# EAGLE design schemat (EAGLE 8.2.2)
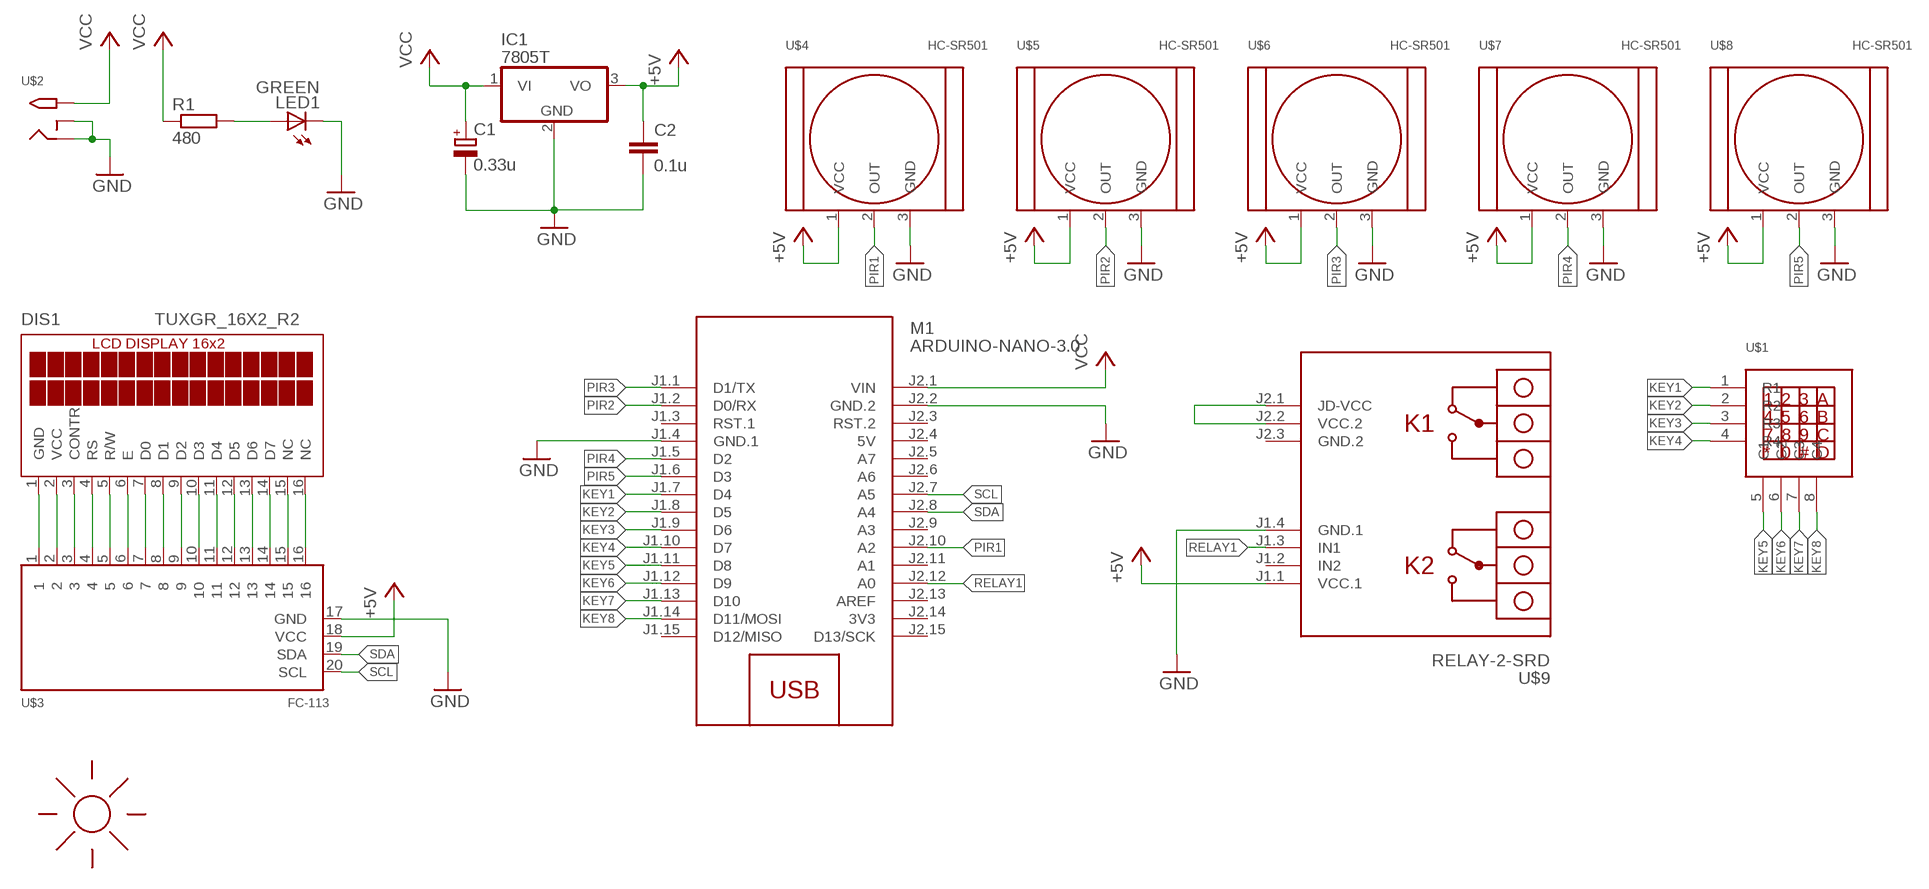
[diagram p0: schematic, sheet 1]

## Parts
C1  0.33u  CPOL-EUE5-4  [E5-4]
C2  0.1u  C-EU050-025X075  [C050-025X075]
DIS1  TUXGR_16X2_R2  [TUXGR_16X2_R2]
IC1  7805T  [TO220H]
LED1  GREEN  LED5MM  [LED5MM]
M1  ARDUINO-NANO-3.0  [ARDUINO-NANO-3.0]
R1  480  R-EU_0204/7  [0204/7]
U$1  KEYPAD4X4  [KEYPAD4X4]
U$2  2.1MMJACKTHM  [PJ-102A]
U$3  FC-113  [FC-113]
U$4  HC-SR501  [HC-SR501]
U$5  HC-SR501  [HC-SR501]
U$6  HC-SR501  [HC-SR501]
U$7  HC-SR501  [HC-SR501]
U$8  HC-SR501  [HC-SR501]
U$9  RELAY-2-SRD  [RELAY-2-SRD]
U$10  SUNLOGO  [SUN]

## Nets
+5V: C2.1 IC1.3(VO) U$3.18(VCC) U$4.1(VCC) U$5.1(VCC) U$6.1(VCC) U$7.1(VCC) U$8.1(VCC) U$9.J1.1(VCC.1)
GND: C1.- C2.2 IC1.2(GND) LED1.K(C) M1.J1.4(GND.1) M1.J2.2(GND.2) U$2.RING U$2.RING_SW U$3.17(GND) U$4.3(GND) U$5.3(GND) U$6.3(GND) U$7.3(GND) U$8.3(GND) U$9.J1.4(GND.1)
KEY1: M1.J1.7(D4) U$1.1(R1)
KEY2: M1.J1.8(D5) U$1.2(R2)
KEY3: M1.J1.9(D6) U$1.3(R3)
KEY4: M1.J1.10(D7) U$1.4(R4)
KEY5: M1.J1.11(D8) U$1.5(C1)
KEY6: M1.J1.12(D9) U$1.6(C2)
KEY7: M1.J1.13(D10) U$1.7(C3)
KEY8: M1.J1.14(D11/MOSI) U$1.8(C4)
N$1: DIS1.15(NC) U$3.15
N$2: LED1.A R1.2
N$5: DIS1.1(GND) U$3.1
N$6: DIS1.2(VCC) U$3.2
N$7: DIS1.3(CONTR) U$3.3
N$8: DIS1.4(RS) U$3.4
N$9: DIS1.5(R/W) U$3.5
N$10: DIS1.6(E) U$3.6
N$11: DIS1.7(D0) U$3.7
N$12: DIS1.8(D1) U$3.8
N$13: DIS1.9(D2) U$3.9
N$14: DIS1.10(D3) U$3.10
N$15: DIS1.11(D4) U$3.11
N$16: DIS1.12(D5) U$3.12
N$17: DIS1.13(D6) U$3.13
N$18: DIS1.14(D7) U$3.14
N$20: DIS1.16(NC) U$3.16
N$30: U$9.J2.1(JD-VCC) U$9.J2.2(VCC.2)
PIR1: M1.J2.10(A2) U$4.2(OUT)
PIR2: M1.J1.2(D0/RX) U$5.2(OUT)
PIR3: M1.J1.1(D1/TX) U$6.2(OUT)
PIR4: M1.J1.5(D2) U$7.2(OUT)
PIR5: M1.J1.6(D3) U$8.2(OUT)
RELAY1: M1.J2.12(A0) U$9.J1.3(IN1)
SCL: M1.J2.7(A5) U$3.20(SCL)
SDA: M1.J2.8(A4) U$3.19(SDA)
VCC: C1.+ IC1.1(VI) M1.J2.1(VIN) R1.1 U$2.TIP
Unconnected: M1.J1.3(RST.1) M1.J1.15(D12/MISO) M1.J2.3(RST.2) M1.J2.5(A7) M1.J2.6(A6) M1.J2.9(A3) M1.J2.11(A1) M1.J2.13(AREF) M1.J2.15(D13/SCK) U$9.J1.2(IN2) U$9.J2.3(GND.2)

## Power pins joined to a net without a drawn wire
3V3: M1.J2.14(3V3)
5V: M1.J2.4(5V)

## Library data of the parts
C1 = resistor:CPOL-EU: POLARIZED CAPACITOR, European symbol
C2 = resistor:C-EU: CAPACITOR, European symbol
DIS1 = display-lcd:TUXGR_16X2_R2: Tuxgraphics LCD display 16x2 characters reflective, without background light Source: tuxgr_12x2_r2.pdf; OC_FARNELL: unknown; OC_NEWARK: unknown
IC1 = adafruit:78*: Positive VOLTAGE REGULATOR Added bigger pads to the TO-92 package
LED1 = adafruit:LED: LED OSRAM: - CHIPLED LG R971, LG N971, LY N971, LG Q971, LY Q971, LO R971, LY R971 LH N974, LH R974 LS Q976, LO Q976, LY Q976 LO Q996 - Hyper CHIPLED LW Q18S LB Q993, LB Q99A, LB R99A - SideLED LS A670, LO A670, LY A670, LG A670, LP A670 LB A673, LV A673, LT A673, LW A673 LH A674 LY A675 LS A676, LA A676, LO A676, LY A676, LW A676 LS A679, LY A679, LG A679 - Hyper Micro SIDELED® LS Y876, LA Y876, LO Y876, LY Y876 LT Y87S - SmartLED LW L88C, LW L88S LB L89C, LB L89S, LG L890 LS L89K, LO L89K, LY L89K LS L896, LA L896, LO L896, LY L896 - TOPLED LS T670, LO T670, LY T670, LG T670, LP T670 LSG T670, LSP T670, LSY T670, LOP T670, LYG T670 LG T671, LOG T671, LSG T671 LB T673, LV T673, LT T673, LW T673 LH T674 LS T676, LA T676, LO T676, LY T676, LB T676, LH T676, LSB T676, LW T676 LB T67C, LV T67C, LT T67C, LS T67K, LO T67K, LY T67K, LW E67C LS E67B, LA E67B, LO E67B, LY E67B, LB E67C, LV E67C, LT E67C LW T67C LS T679, LY T679, LG T679 LS T770, LO T770, LY T770, LG T770, LP T770 LB T773, LV T773, LT T773, LW T773 LH T774 LS E675, LA E675, LY E675, LS T675 LS T776, LA T776, LO T776, LY T776, LB T776 LHGB T686 LT T68C, LB T68C - Hyper Mini TOPLED® LB M676 - Mini TOPLED Santana® LG M470 LS M47K, LO M47K, LY M47K Source: http://www.osram.convergy.de/
M1 = diy-modules:ARDUINO-NANO-3.0: Arduino Nano 3.0 and compatible devices More details available here: https://www.arduino.cc/en/Main/ArduinoBoardNano Click here to find device on ebay.com <http://www.ebay.com/sch/arduino+nano>
R1 = resistor:R-EU_: RESISTOR, European symbol
U$1 = keypad4x4_ece:KEYPAD4X4
U$2 = adafruit:2.1MMJACK: 2.1mm x 5.5mm THM DC jack with internal switch. Digikey part #PJ-102A, 4UCON part #05537 2.1mm x 5.5mm SMT DC jack with internal switch. Digikey part #PJ-002A-SMT, 4UCON part #03267 By microbuilder.eu & adafruit.com
U$3 = brakujace_alarm:FC-113
U$4-U$8 = brakujace_alarm:HC-SR501: PIR sensor module
U$9 = diy-modules:RELAY-2-SRD: 2-Channel Relay Module based on SRD-05VDC-SL-C relays Click here to find device on ebay.com <http://www.ebay.com/sch/two+channel+relay+module+optocoupler+5v>
U$10 = adafruit:SUNLOGO: Just a SMT logo of a sun. cute!

## Module FC-113
Ports: 

### Library data of the parts

## Board
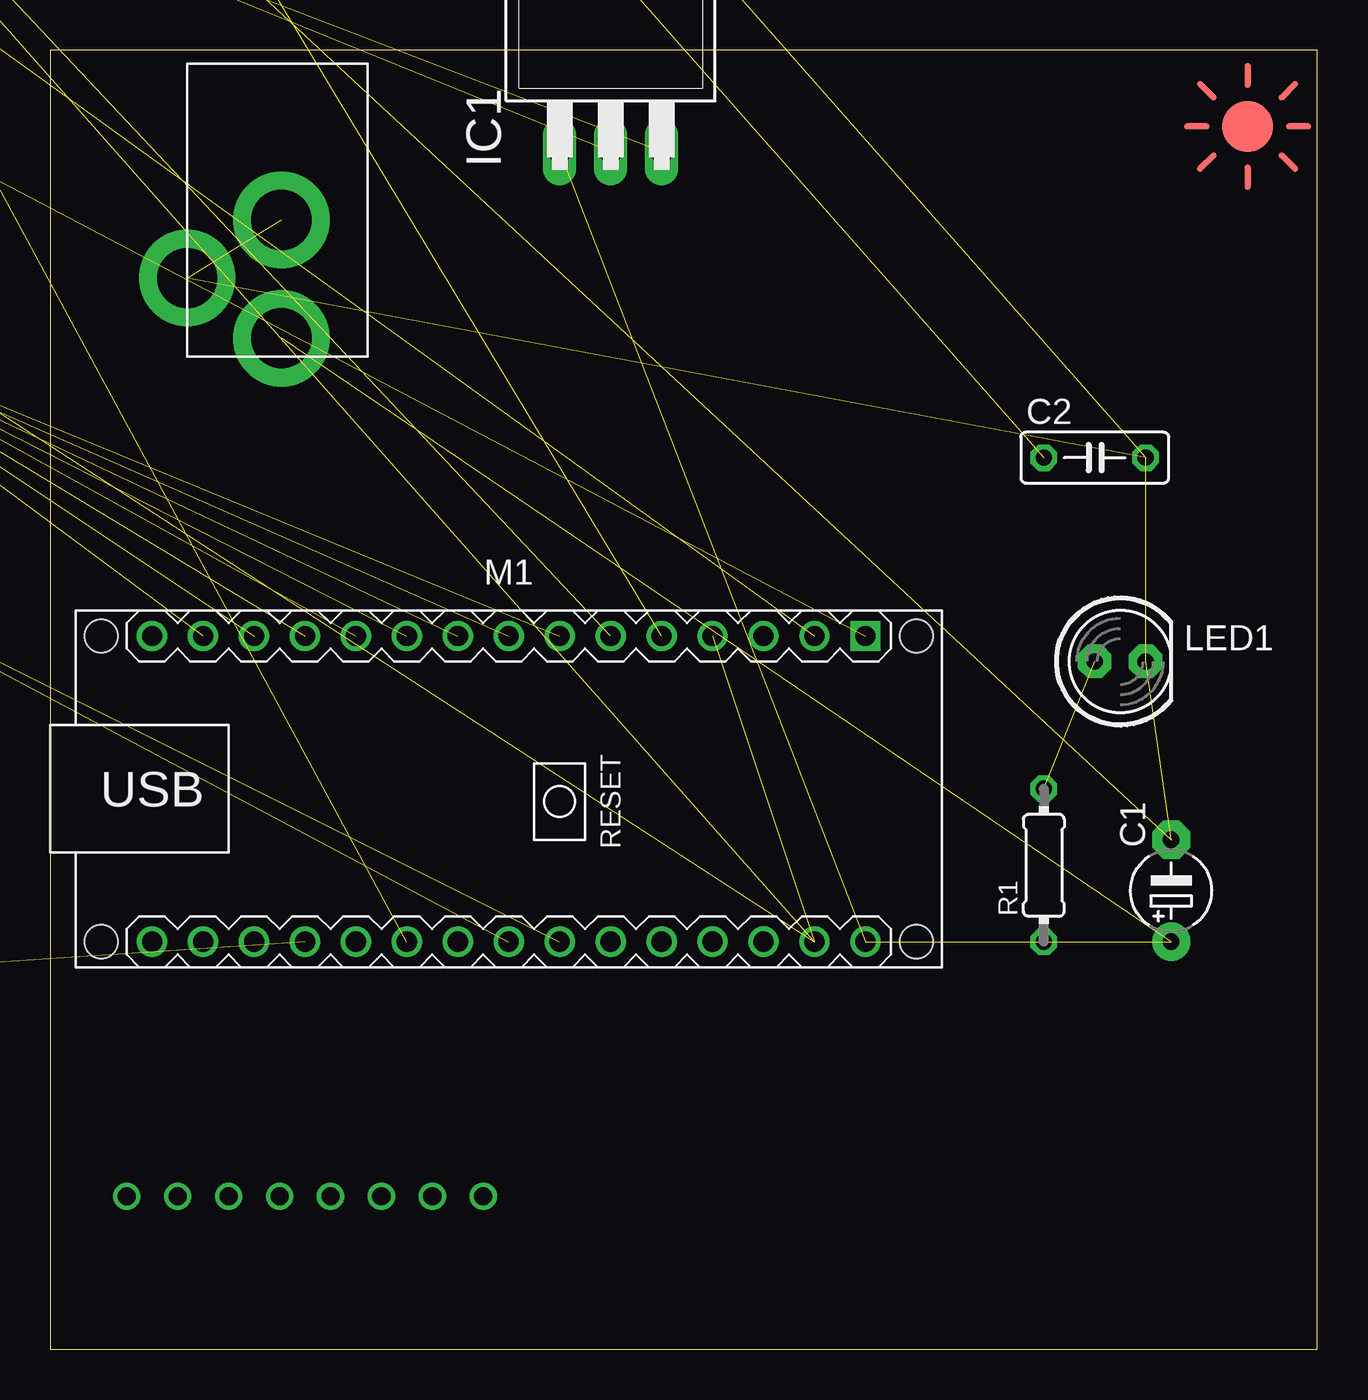
[diagram p1: board, top side]

Size 63.17 x 64.76 mm. Coordinates in mm from the lower left corner, seen from the top.
Outline: 0,0 63.17,0 63.17,64.76 0,64.76 0,0
Copper layers (1*16): Top 0.035mm / dielectric 1.5mm / Bottom 0.035mm
Design rules "default": minimum track width 6mil, minimum drill 0.35mm, track to track 6mil, track to pad 6mil, pad to pad 6mil, via to via 6mil, smd to smd 6mil, copper to edge 40mil, drill to drill 6mil, minimum pad ring 10mil, minimum via ring 8mil, stop-mask expansion 4mil, vias tented up to drill 0mil, thermal gap 10mil

### Footprints (pad centres in the part's own frame; a part is rotated, then mirrored left to right if it is on the bottom)
E5-4 = drill 0.813 pad 1.905: + -2.54,0 | drill 0.813 pad 1.905 octagon: - 2.54,0
C050-025X075 = drill 0.813 octagon: 1 -2.54,0; 2 2.54,0
TUXGR_16X2_R2 = drill 1 pad 1.676: 1 -32,15.5; 2 -29.46,15.5; 3 -26.92,15.5; 4 -24.38,15.5; 5 -21.84,15.5; 6 -19.3,15.5; 7 -16.76,15.5; 8 -14.22,15.5; 9 -11.68,15.5; 10 -9.14,15.5; 11 -6.6,15.5; 12 -4.06,15.5; 13 -1.52,15.5; 14 1.02,15.5; 15 3.56,15.5; 16 6.1,15.5 | hole 2.5: -37.5,-15.5; 37.5,-15.5; -37.5,15.5; 37.5,15.5
TO220H = drill 1.118 long: 1 -2.54,-10.16; 2 0,-10.16; 3 2.54,-10.16 | hole 3.302: 0,4.826
LED5MM = drill 0.813 pad 1.676 octagon: A -1.27,0; K 1.27,0
ARDUINO-NANO-3.0 = drill 1 square: J1.1 17.78,7.62 | drill 1: J1.2 15.24,7.62; J1.3 12.7,7.62; J1.4 10.16,7.62; J1.5 7.62,7.62; J1.6 5.08,7.62; J1.7 2.54,7.62; J1.8 0,7.62; J1.9 -2.54,7.62; J1.10 -5.08,7.62; J1.11 -7.62,7.62; J1.12 -10.16,7.62; J1.13 -12.7,7.62; J1.14 -15.24,7.62; J1.15 -17.78,7.62; J2.1 17.78,-7.62; J2.2 15.24,-7.62; J2.3 12.7,-7.62; J2.4 10.16,-7.62; J2.5 7.62,-7.62; J2.6 5.08,-7.62; J2.7 2.54,-7.62; J2.8 0,-7.62; J2.9 -2.54,-7.62; J2.10 -5.08,-7.62; J2.11 -7.62,-7.62; J2.12 -10.16,-7.62; J2.13 -12.7,-7.62; J2.14 -15.24,-7.62; J2.15 -17.78,-7.62 | hole 1.651: -20.32,7.62; -20.32,-7.62; 20.32,-7.62; 20.32,7.62
0204/7 = drill 0.813 octagon: 1 -3.81,0; 2 3.81,0
KEYPAD4X4 = drill 1.016 long: 1 -13.97,1.27; 2 -11.43,1.27; 3 -8.89,1.27; 4 -6.35,1.27; 5 -3.81,1.27; 6 -1.27,1.27; 7 1.27,1.27; 8 3.81,1.27
PJ-102A = drill 3 pad 4.8: RING 0.1,-3.39; RING_SW -4.6,-6.29; TIP 0.1,-9.29
FC-113 = drill 0.9 square: 1 -20.32,7.62; 2 -17.78,7.62; 3 -15.24,7.62; 4 -12.7,7.62; 5 -10.16,7.62; 6 -7.62,7.62; 7 -5.08,7.62; 8 -2.54,7.62; 9 0,7.62; 10 2.54,7.62; 11 5.08,7.62; 12 7.62,7.62; 13 10.16,7.62; 14 12.7,7.62; 15 15.24,7.62; 16 17.78,7.62; 17 17.78,2.54; 18 17.78,0; 19 17.78,-2.54; 20 17.78,-5.08
HC-SR501 = drill 0.9 square: 1 -2.54,-8.89; 2 0,-8.89; 3 2.54,-8.89
RELAY-2-SRD = drill 1 square: J1.1 21.59,11.43; J2.1 21.59,-11.43 | drill 1: J1.2 21.59,8.89; J1.3 21.59,6.35; J1.4 21.59,3.81; J2.2 21.59,-8.89; J2.3 21.59,-6.35 | hole 3: -22.225,16.51; 22.225,16.51; 22.225,-16.51; -22.225,-16.51
SUN = smd 2.54 x 2.54: P$1 0,0 | smd 0.305 x 1.27: P$2 0,2.54; P$3 0,-2.54 | smd 1.27 x 0.305: P$4 2.54,0; P$5 -2.54,0 | smd 1.27 x 0.305 rotated 45: P$6 2.032,1.778 | smd 1.27 x 0.305 rotated 135: P$7 2.032,-1.778 | smd 1.27 x 0.305 rotated 225: P$8 -2.032,-1.778 | smd 1.27 x 0.305 rotated 315: P$9 -2.032,1.778

### Placement (x,y rotation side)
C1  55.88,22.86 90 top
C2  52.07,44.45 0 top
DIS1  -53.34,91.44 0 top  (outside the outline)
IC1  27.94,69.85 0 top
LED1  53.34,34.29 0 top
M1  22.86,27.94 0 top
R1  49.53,24.13 90 top
U$1  -40.64,67.31 0 top  (outside the outline)
U$2  11.43,59.69 0 top
U$3  -114.3,86.36 0 top  (outside the outline)
U$4  -33.02,123.19 0 top  (outside the outline)
U$5  -71.12,123.19 0 top  (outside the outline)
U$6  -109.22,123.19 0 top  (outside the outline)
U$7  -33.02,149.86 0 top  (outside the outline)
U$8  -71.12,149.86 0 top  (outside the outline)
U$9  -104.14,7.62 0 top  (outside the outline)
U$10  59.69,60.96 0 top

### Tracks (layer width: path | path; a pad name or v marks a point on that pad's centre or on a via)
+5V  (8 unrouted)
GND  (14 unrouted)
KEY1  (1 unrouted)
KEY2  (1 unrouted)
KEY3  (1 unrouted)
KEY4  (1 unrouted)
KEY5  (1 unrouted)
KEY6  (1 unrouted)
KEY7  (1 unrouted)
KEY8  (1 unrouted)
N$1  (1 unrouted)
N$2  (1 unrouted)
N$3  (via drill 0.9)
  other vias: 3.81,7.62
N$4  (via drill 0.9)
  other vias: 6.35,7.62
N$5  (1 unrouted)
N$6  (1 unrouted)
N$7  (1 unrouted)
N$8  (1 unrouted)
N$9  (1 unrouted)
N$10  (1 unrouted)
N$11  (1 unrouted)
N$12  (1 unrouted)
N$13  (1 unrouted)
N$14  (1 unrouted)
N$15  (1 unrouted)
N$16  (1 unrouted)
N$17  (1 unrouted)
N$18  (1 unrouted)
N$19  (via drill 0.9)
  other vias: 8.89,7.62
N$20  (1 unrouted)
N$21  (via drill 0.9)
  other vias: 11.43,7.62
N$22  (via drill 0.9)
  other vias: 13.97,7.62
N$23  (via drill 0.9)
  other vias: 16.51,7.62
N$24  (via drill 0.9)
  other vias: 19.05,7.62
N$25  (via drill 0.9)
  other vias: 21.59,7.62
N$30  (1 unrouted)
PIR1  (1 unrouted)
PIR2  (1 unrouted)
PIR3  (1 unrouted)
PIR4  (1 unrouted)
PIR5  (1 unrouted)
RELAY1  (1 unrouted)
SCL  (1 unrouted)
SDA  (1 unrouted)
VCC  (4 unrouted)